# EAGLE schematic UTN-ESEXT01 (EAGLE 8.3.1)
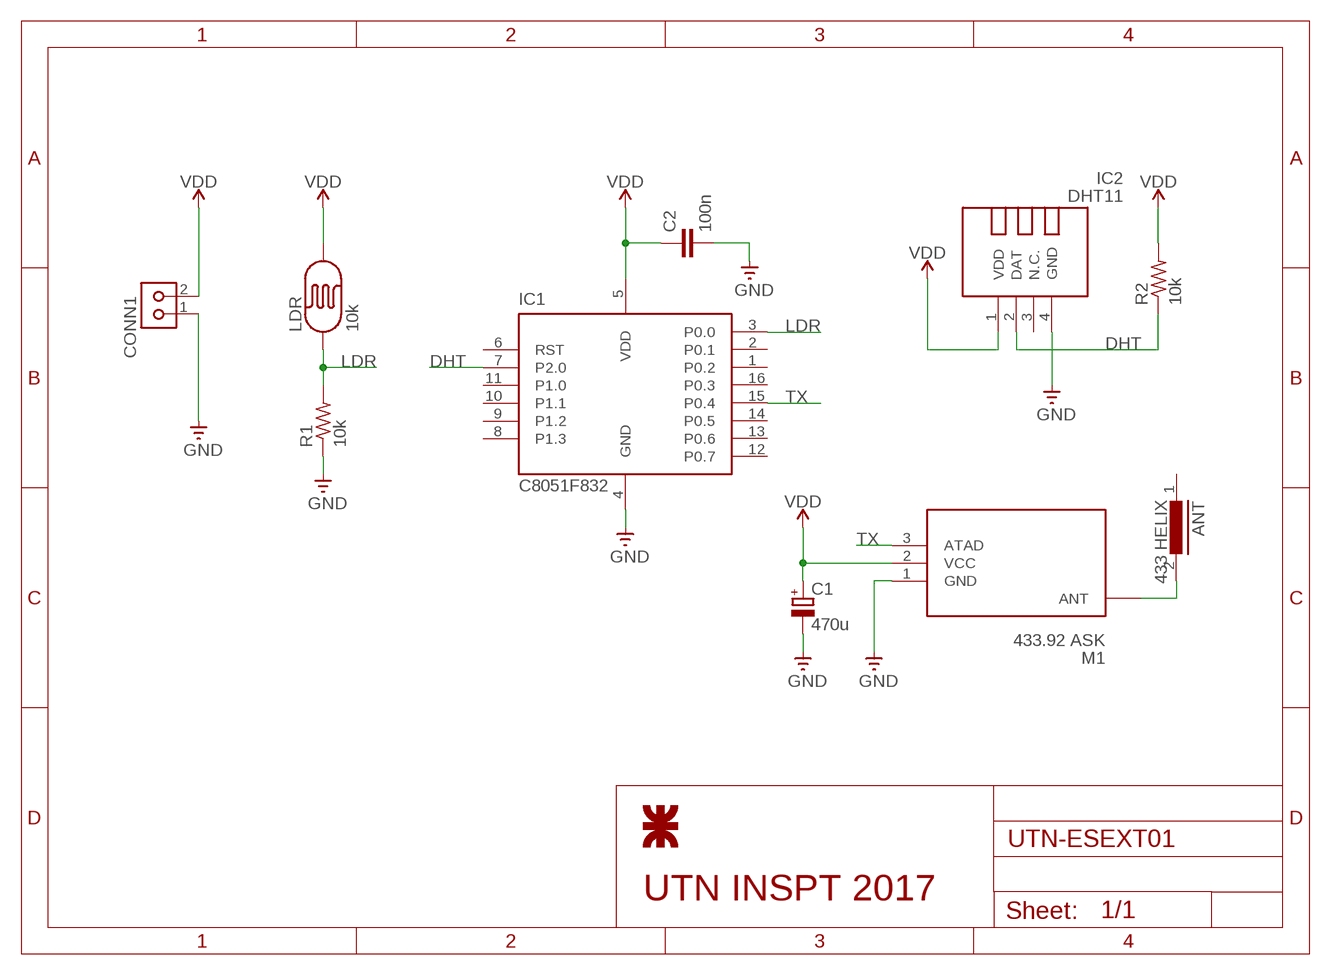
[diagram p0: schematic, sheet 1]

## Parts
ANT  433 HELIX  SMSC20  [SMSC20]
C1  470u  CPOL-EUE3.5-10  [E3,5-10]
C2  100n  C-EU050-024X044  [C050-024X044]
CONN1  KK2VSQ  [KK-V-2-SQ]
IC1  C8051F832  [SOIC16R]
IC2  DHT11  TEMP-HUM-SENSOR-DHT11  [TEMP-HUM-SENSOR-DHT11]
LDR  10k  PHOTOCELLONB  [ON_BOARD]
M1  433.92 ASK  WIRELESS-XY-FST  [WIRELESS-XY-FST]
R1  10k  R-US_0207/10  [0207/10]
R2  10k  R-US_0207/10  [0207/10]
U$3  UTN_LOGO  [UTN_LOGO]

## Nets
DHT: IC1.7(P2.0) IC2.2(DAT) R2.1
GND: C1.- C2.2 CONN1.1 IC1.4(GND) IC2.4(GND) M1.1(GND) R1.1
LDR: IC1.3(P0.0) LDR.1 R1.2
N$1: ANT.2 M1.ANT
TX: IC1.15(P0.4) M1.3(ATAD)
VDD: C1.+ C2.1 CONN1.2 IC1.5(VDD) IC2.1(VDD) LDR.2 M1.2(VCC) R2.2
Unconnected: ANT.1 IC1.1(P0.2) IC1.2(P0.1) IC1.6(RST) IC1.8(P1.3) IC1.9(P1.2) IC1.10(P1.1) IC1.11(P1.0) IC1.12(P0.7) IC1.13(P0.6) IC1.14(P0.5) IC1.16(P0.3) IC2.3(N.C.)

## Notes on the sheet
- UTN INSPT 2017

## Library data of the parts
ANT = inductors:SMSC20: INDUCTOR
C1 = rcl:CPOL-EU: POLARIZED CAPACITOR, European symbol
C2 = rcl:C-EU: CAPACITOR, European symbol
CONN1 = molex-kk:KK2*: Molex KK 2-pin connector, 100 mil pin spacing
IC1 = silabs-2:C8051F832: 8kB ILP Flash MCU Family Source: www.silabs.com .. C8051F33x.pdf
IC2 = diy-modules:TEMP-HUM-SENSOR-DHT11: DHT11 - digital humidity & temperature sensor DHT11 datasheet available here: https://akizukidenshi.com/download/ds/aosong/DHT11.pdf Click here to find device on ebay.com <http://www.ebay.com/sch/dht11+digital+sensor>
LDR = LDR:PHOTOCELL: Photo Resitor
M1 = diy-modules:WIRELESS-XY-FST: RF Wireless XY-FST Transmitter Click here to find device on ebay.com <http://www.ebay.com/sch/xd+fst+transmitter> Note: Sold together with receiver.
R1 R2 = rcl:R-US_: RESISTOR, American symbol
U$3 = UTN_LOGO:UTN_LOGO